# EasyEDA Pro project PelletMonV3.eprj

# Schematic Schematic
Create Date: 2023-02-23; Page Name: P1; Project Name: PelletMonV3; Schematic Name: Schematic; Update Date: 2023-03-02; Company: cziter15/czarnykon; Drawed: Krzysztof Strehlau; Page Size: A4; Part Number: pcbv3; Reviewed: Krzysztof Strehlau; Version: 3
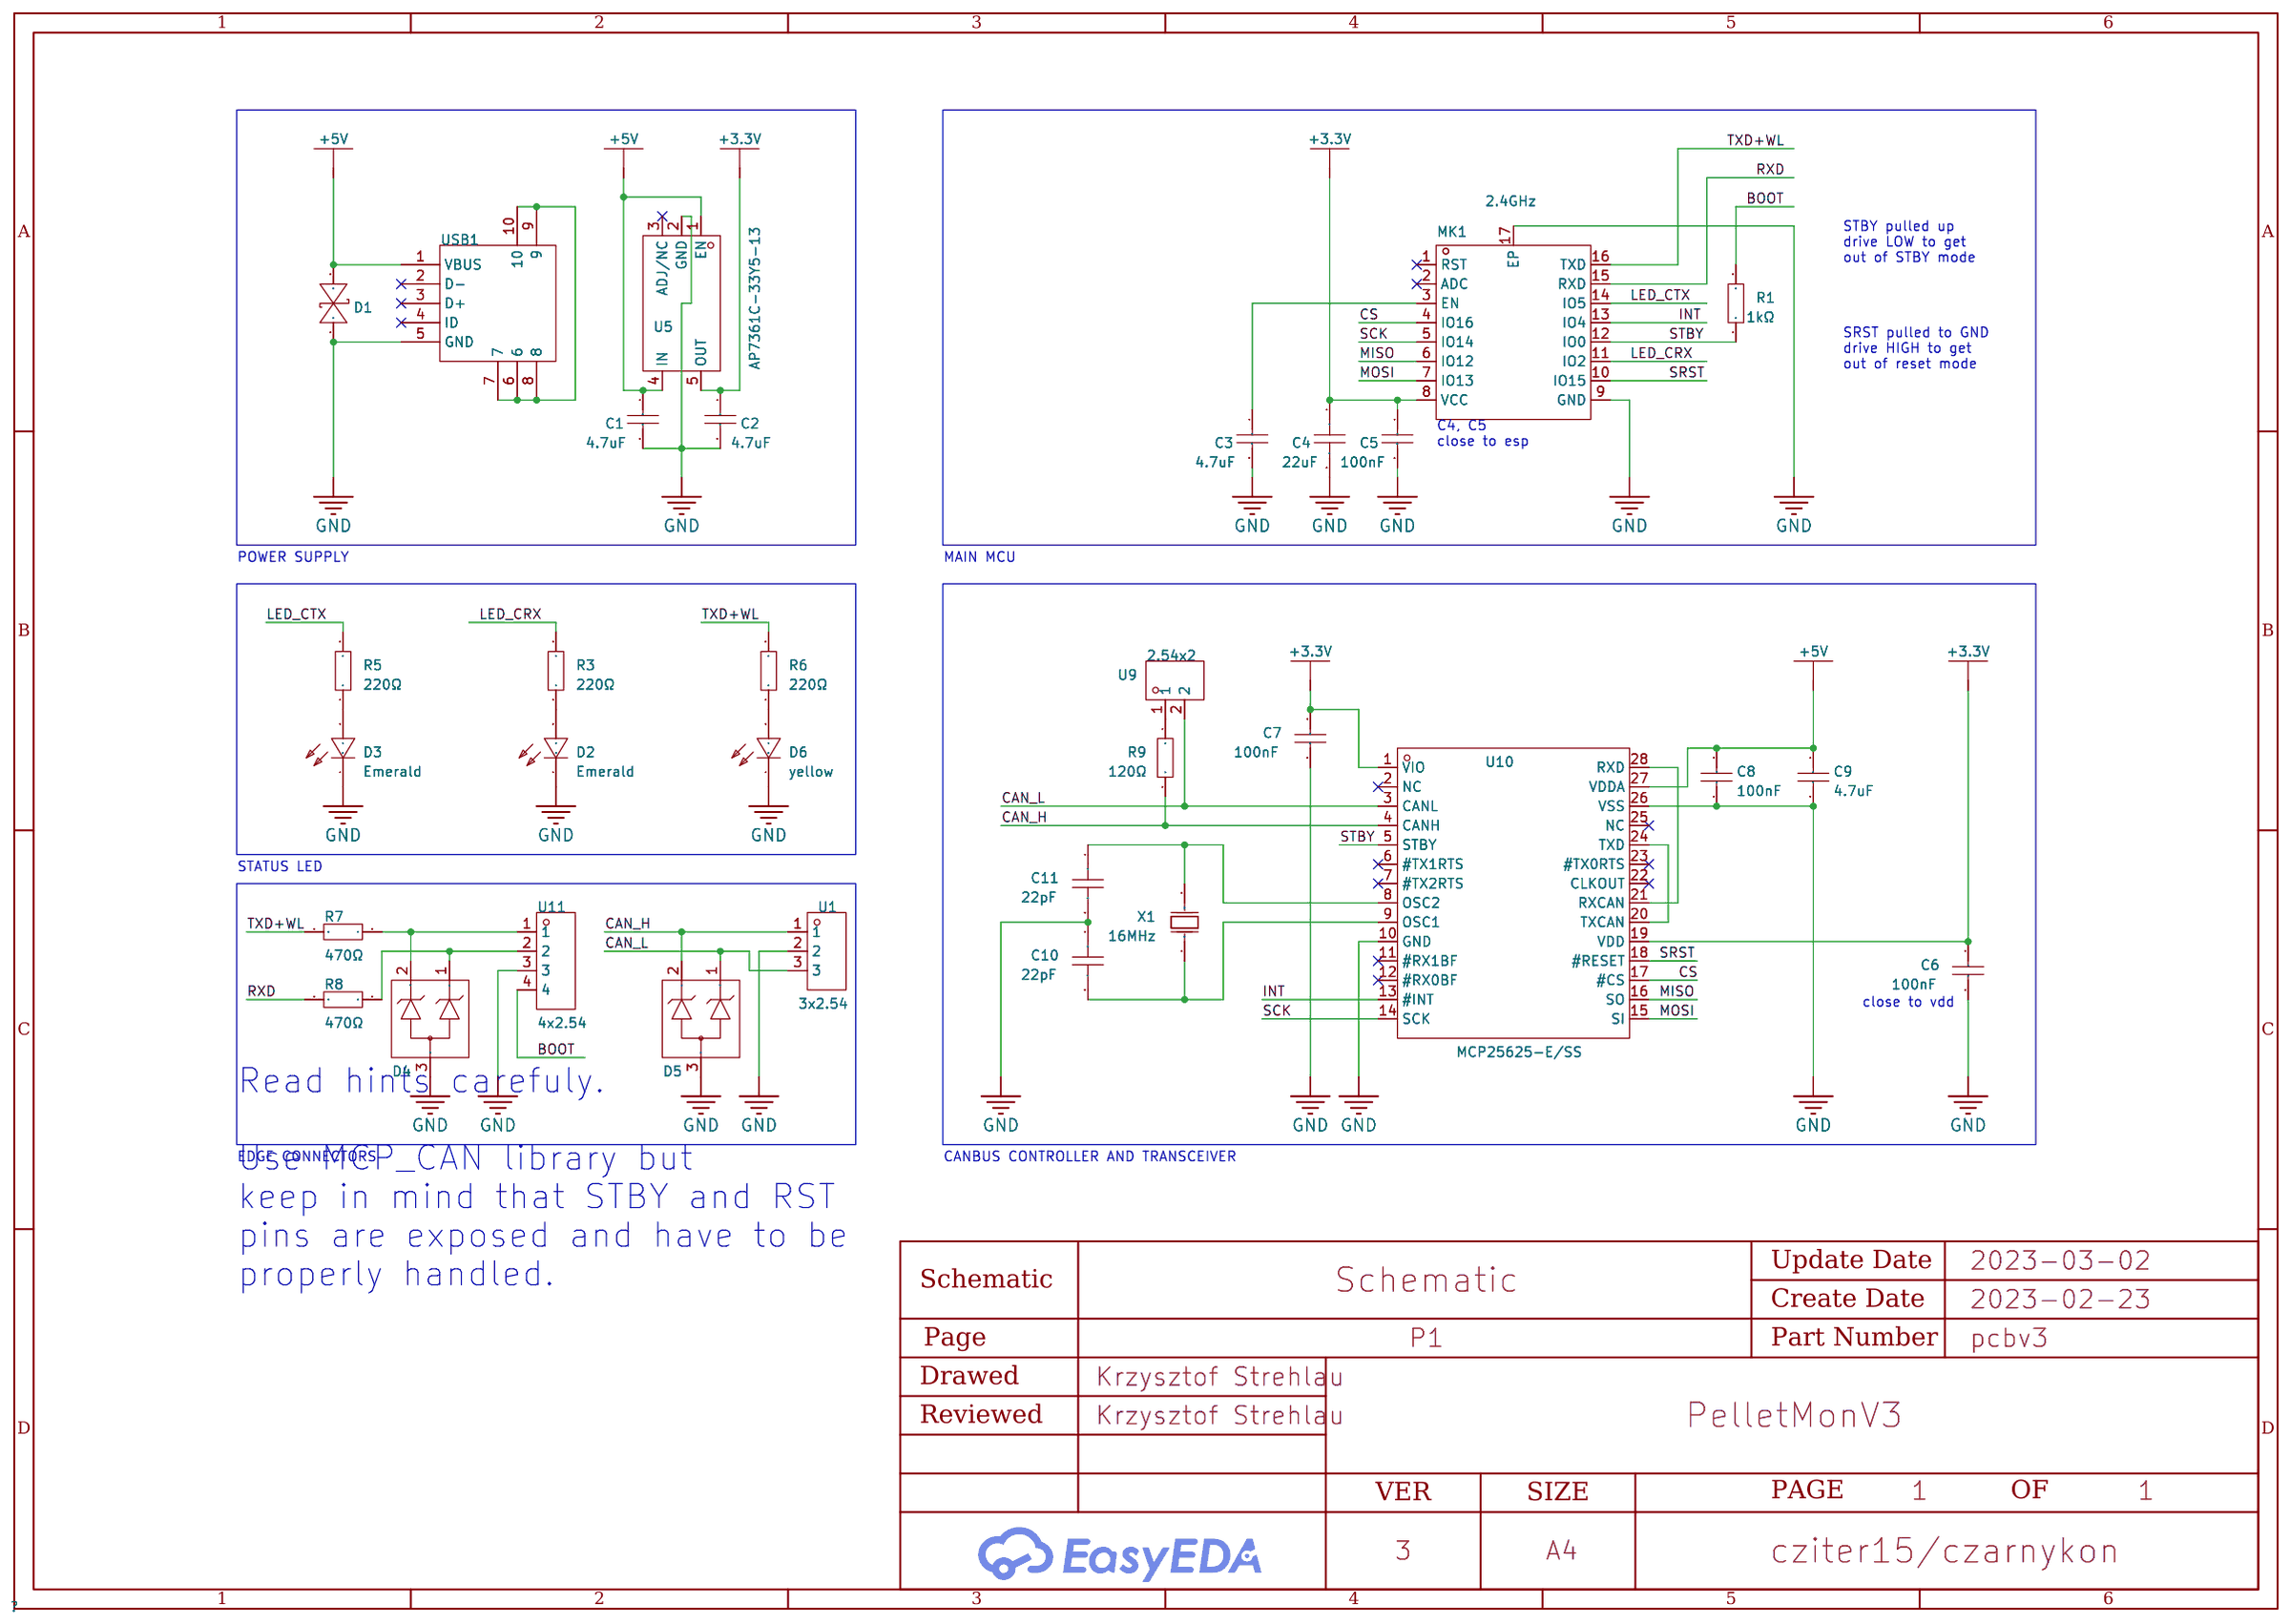
[diagram p0: schematic sheet]

## Parts
C1  4.7uF  [C0805]
C2  4.7uF  [C0805]
C3  4.7uF  [C0805]
C4  22uF  [C0805]
C5  100nF  [C0603]
C6  100nF  [C0603]
C7  100nF  [C0603]
C8  100nF  [C0603]
C9  4.7uF  [C0805]
C10  22pF  [C0603]
C11  22pF  [C0603]
D1  PESD0603-240  [D0603-BI]
D2  Emerald  [LED0603-RD]
D3  Emerald  [LED0603-RD]
D4  PESD3V3S2UT  [SOT-23-3_L3.0-W1.7-P0.95-LS2.9-BR]
D5  PESD2CAN  [SOT-23-3_L2.9-W1.3-P1.90-LS2.4-BR]
D6  yellow  [LED0603-RD]
MK1  2.4GHz  [WIRELM-SMD_ESP-07S]
R1  1kΩ  [R0603]
R3  220Ω  [R0603]
R5  220Ω  [R0603]
R6  220Ω  [R0603]
R7  470Ω  [R0603]
R8  470Ω  [R0603]
R9  120Ω  [R0603]
U1  3x2.54  [CONN-TH_DB125-2.54-3P-GN]
U5  AP7361C-33Y5-13  [SOT-89-5_L4.5-W2.5-P1.50-LS4.5-BR]
U9  2.54x2  [CONN-TH_DB125-2.54-2P-GN]
U10  MCP25625-E/SS  [SSOP-28_L10.2-W5.3-P0.65-LS7.8-BL]
U11  4x2.54  [CONN-TH_DB125-2.54-4P-GN]
USB1  475900001  [MICRO-USB-SMD_47590-0001]
X1  16MHz  [OSC-SMD_L5.0-W3.2]

## Library data of the parts
C1-C3 C9 = CL21A475KAQNNNE: Capacitance: Tolerance:±10% Tolerance:±10% Voltage Rated: Temperature Coefficient:; LCSC Part Name: 4.7uF ±10% 25V; Supplier Part: C1779; Manufacturer: SAMSUNG(三星); Supplier Footprint: 0805; JLCPCB Part Class: Basic Part; Datasheet: https://atta.szlcsc.com/upload/public/pdf/source/20160103/1457707696447.pdf; Supplier: LCSC; Tolerance: ±10%; Check: true
C4 = CL21A226MAQNNNE_C45783: Capacitance: Tolerance:±20% Tolerance:±20% Voltage Rated: Temperature Coefficient:; LCSC Part Name: 22uF ±20% 25V; Supplier Part: C45783; Manufacturer: SAMSUNG(三星); Manufacturer Part: CL21A226MAQNNNE; Supplier Footprint: 0805; JLCPCB Part Class: Basic Part; Datasheet: https://atta.szlcsc.com/upload/public/pdf/source/20160103/1457707727161.pdf; Supplier: LCSC; Tolerance: ±20%; Check: true
C5-C8 = CC0603KRX7R9BB104: Capacitance: Tolerance:±10% Tolerance:±10% Voltage Rated: Temperature Coefficient:; LCSC Part Name: 100nF ±10% 50V; Supplier Part: C14663; Manufacturer: YAGEO(国巨); Supplier Footprint: 0603; JLCPCB Part Class: Basic Part; Datasheet: https://atta.szlcsc.com/upload/public/pdf/source/20170116/1484561234239.pdf; Supplier: LCSC; Tolerance: ±10%; Check: true
C10 C11 = CC0603FRNPO9BN220: Capacitance: Tolerance:±1% Tolerance:±1% Voltage Rated: Temperature Coefficient:; LCSC Part Name: 22pF ±1% 50V; Supplier Part: C326840; Manufacturer: YAGEO(国巨); Supplier Footprint: 0603; JLCPCB Part Class: Extended Part; Datasheet: https://atta.szlcsc.com/upload/public/pdf/source/20181031/C326840_4CFD83C448EE131B1A0D2E7D8F466B49.pdf; Supplier: LCSC; Tolerance: ±1%
D1 = PESD0603-240: Polarity:Bi-Directional Reverse Stand-Off Voltage (Vrwm):5V Breakdown Voltage (Min):6.4V Breakdown Voltage (Max):7V Reverse Leakage Current (Ir):800uA Peak Pulse Current (Ipp)@10/1000μs:43.5A Maximum Clamping Voltage:9.2V; Supplier Part: C133012; Manufacturer: Brightking(君耀电子); Supplier Footprint: 0603; JLCPCB Part Class: Extended Part; Datasheet: https://atta.szlcsc.com/upload/public/pdf/source/20170930/C133012_1506736373101997361.pdf; Supplier: LCSC; Polarity: Bi-Directional; Reverse Stand-Off Voltage (Vrwm): 5V; Breakdown Voltage (Min): 6.4V; Breakdown Voltage (Max): 7V; Reverse Leakage Current (Ir): 800uA; Peak Pulse Current (Ipp)@10/1000μs: 43.5A; Maximum Clamping Voltage: 9.2V
D2 D3 = 19-217/GHC-YR1S2/3T: Emitted Color:Emerald Diode Configuration:- Lens Color:Colorless transparence Dominant Wavelength:520nm~535nm Dominant Wavelength:520nm~535nm Peak Wavelength:518nm Color Temperature:- Color Temperature:- Forward Current:20mA Power Dissipation:110mW Viewin; LCSC Part Name: 翠绿 520nm~535nm; Supplier Part: C72043; Manufacturer: EVERLIGHT(亿光); Supplier Footprint: 0603; JLCPCB Part Class: Basic Part; Datasheet: https://atta.szlcsc.com/upload/public/pdf/source/20160507/1462613613780.pdf; Supplier: LCSC; Lens Color: Colorless transparence; Dominant Wavelength: 520nm~535nm; Peak Wavelength: 518nm; Forward Current: 20mA; Power Dissipation: 110mW; Viewing Angle: 120°; Operating Temperature: -40℃~+85℃
D4 = PESD3V3S2UT: Supplier Part: C388581; Supplier Footprint: SOT-23; JLCPCB Part Class: Extended Part; Datasheet: https://atta.szlcsc.com/upload/public/pdf/source/20190611/C388581_08CD3BED48EF46BEAD1C9C0FD641C393.pdf; Supplier: LCSC
D5 = PESD2CAN: Polarity:Bi-Directional Reverse Stand-Off Voltage (Vrwm):24V@Max Breakdown Voltage:26.7V Peak Pulse Current (Ipp)@10/1000μs:8A@8/20us Maximum Clamping Voltage:54V; LCSC Part Name: 双向 Vrwm:24V@Max; Supplier Part: C284078; Manufacturer: DOWO(东沃); Supplier Footprint: SOT-23; JLCPCB Part Class: Extended Part; Datasheet: https://atta.szlcsc.com/upload/public/pdf/source/20180918/C284078_DC297CB2BF89271044F07577A109ECB3.pdf; Supplier: LCSC; Polarity: Bi-Directional; Reverse Stand-Off Voltage (Vrwm): 24V@Max; Breakdown Voltage: 26.7V; Peak Pulse Current (Ipp)@10/1000μs: 8A@8/20us; Maximum Clamping Voltage: 54V
D6 = 19-213/Y2C-CQ2R2L/3T(CY): Emitted Color:yellow Diode Configuration:- Lens Color:Colorless transparence Dominant Wavelength:585.5nm~591.5nm Dominant Wavelength:585.5nm~591.5nm Peak Wavelength:591nm Color Temperature:- Color Temperature:- Forward Current:20mA Power Dissipation:60mW; LCSC Part Name: 黄灯 585.5nm~591.5nm; Supplier Part: C72038; Manufacturer: EVERLIGHT(亿光); Supplier Footprint: 0603; JLCPCB Part Class: Basic Part; Datasheet: https://atta.szlcsc.com/upload/public/pdf/source/20160507/1462613613586.pdf; Supplier: LCSC; Lens Color: Colorless transparence; Dominant Wavelength: 585.5nm~591.5nm; Peak Wavelength: 591nm; Forward Current: 20mA; Power Dissipation: 60mW; Viewing Angle: 120°; Operating Temperature: -40℃~+85℃
MK1 = ESP-07S_C82895: Frequency:2.4GHz Output Power:19.5dBm Output Power:19.5dBm Core Processor:ESP8266 Support Interface:I2C；HSPI；UART；I2S Antenna Type:PCB 板载天线 Wireless Standard:802.11b/g/n Operating Voltage:3.3V Operating Voltage:3.3V Receive  Current:- Send  Current:- Sens; LCSC Part Name: ESP-07S; Supplier Part: C82895; Manufacturer: Ai-Thinker(安信可); Manufacturer Part: ESP-07S; Supplier Footprint: WIFI Module; JLCPCB Part Class: Extended Part; Datasheet: https://atta.szlcsc.com/upload/public/pdf/source/20161024/1477288471743.pdf; Supplier: LCSC; Output Power: 19.5dBm; Core Processor: ESP8266; Support Interface: I2C；HSPI；UART；I2S; Antenna Type: PCB 板载天线; Wireless Standard: 802.11b/g/n; Operating Voltage: 3.3V; Sensitivity: -98dBm; Operating Temperature: -40℃~+125℃
R1 = 0603WAF1001T5E: Type:Thick Film Resistors Resistance: Tolerance:±1% Tolerance:±1% Power(Watts): Temperature Coefficient:±100ppm/℃ Temperature Coefficient:±100ppm/℃ Overload Voltage (Max): Operating Temperature Range:-55℃~+155℃ Operating Temperature Range:-55℃~+155℃; LCSC Part Name: 1kΩ ±1% 100mW; Supplier Part: C21190; Manufacturer: UNI-ROYAL(厚声); Supplier Footprint: 0603; JLCPCB Part Class: Basic Part; Datasheet: https://atta.szlcsc.com/upload/public/pdf/source/20200306/C422600_1E6D84923E4A46A82E41ADD87F860B5C.pdf; Supplier: LCSC; Type: Thick Film Resistors; Tolerance: ±1%; Temperature Coefficient: ±100ppm/℃; Operating Temperature Range: -55℃~+155℃
R3 R5 R6 = 0603WAF2200T5E: Type:Thick Film Resistors Resistance: Tolerance:±1% Tolerance:±1% Power(Watts): Temperature Coefficient:±100ppm/℃ Temperature Coefficient:±100ppm/℃ Overload Voltage (Max): Operating Temperature Range:-55℃~+155℃ Operating Temperature Range:-55℃~+155℃; LCSC Part Name: 220Ω ±1% 100mW; Supplier Part: C22962; Manufacturer: UNI-ROYAL(厚声); Supplier Footprint: 0603; JLCPCB Part Class: Basic Part; Datasheet: https://atta.szlcsc.com/upload/public/pdf/source/20200306/C422600_1E6D84923E4A46A82E41ADD87F860B5C.pdf; Supplier: LCSC; Type: Thick Film Resistors; Tolerance: ±1%; Temperature Coefficient: ±100ppm/℃; Operating Temperature Range: -55℃~+155℃; Check: true
R7 R8 = 0603WAF4700T5E: Type:Thick Film Resistors Resistance: Tolerance:±1% Tolerance:±1% Power(Watts): Temperature Coefficient:±100ppm/℃ Temperature Coefficient:±100ppm/℃ Overload Voltage (Max): Operating Temperature Range:-55℃~+155℃ Operating Temperature Range:-55℃~+155℃; LCSC Part Name: 470Ω(4700) ±1% 编带; Supplier Part: C23179; Manufacturer: UNI-ROYAL(厚声); Supplier Footprint: 0603; JLCPCB Part Class: Basic Part; Datasheet: https://atta.szlcsc.com/upload/public/pdf/source/20170920/C23179_1505901118208982562.pdf; Supplier: LCSC; Tolerance: ±1%; Temperature Coefficient: ±100ppm/℃; Operating Temperature Range: -55℃~+155℃; Type: Thick Film Resistors; Check: true
R9 = 0603WAF1200T5E: Type:Thick Film Resistors Resistance: Tolerance:±1% Tolerance:±1% Power(Watts): Temperature Coefficient:±100ppm/℃ Temperature Coefficient:±100ppm/℃ Overload Voltage (Max): Operating Temperature Range:-55℃~+155℃ Operating Temperature Range:-55℃~+155℃; LCSC Part Name: 120Ω ±1% 100mW; Supplier Part: C22787; Manufacturer: UNI-ROYAL(厚声); Supplier Footprint: 0603; JLCPCB Part Class: Basic Part; Datasheet: https://atta.szlcsc.com/upload/public/pdf/source/20200306/C422600_1E6D84923E4A46A82E41ADD87F860B5C.pdf; Supplier: LCSC; Type: Thick Film Resistors; Tolerance: ±1%; Temperature Coefficient: ±100ppm/℃; Operating Temperature Range: -55℃~+155℃
U1 = DB125-2.54-3P-GN-S: Pitch:2.54mm Number of Rows:1 Number of PINs Per Row:3 Mounting Style:直针 Current Rating (Max):8A Voltage Rating (Max):130V Wire Gauge - AWG:18~26 Wire Gauge - AWG:18~26 Wire Gauge - mm2:0.5~1 Wire Gauge - mm2:0.5~1 Operating Temperature Range:-40℃~+105℃ O; LCSC Part Name: 2.54mm 排数:1 每排P数:3 直针; Supplier Part: C918121; Manufacturer: DIBO(地博电气); Supplier Footprint: 插件,P=2.54mm; JLCPCB Part Class: Extended Part; Datasheet: https://atta.szlcsc.com/upload/public/pdf/source/20201111/C918120_C9DB7F6F3DB366529A80D61CABEEDAE6.pdf; Supplier: LCSC; Pitch: 2.54mm; Number of Rows: 1; Number of PINs Per Row: 3; Mounting Style: 直针; Current Rating (Max): 8A; Voltage Rating (Max): 130V; Wire Gauge - AWG: 18~26; Wire Gauge - mm2: 0.5~1; Operating Temperature Range: -40℃~+105℃; Check: true
U5 = AP7361C-33Y5-13: Output Type: Output Polarity:Positive Number of Outputs:1 Maximum Input Voltage:6V Output Voltage:3.3V~3.3V Output Voltage:3.3V~3.3V Dropout Voltage:360mV@(1A) Output Current:1A Power Supply Rejection Ratio (PSRR):75dB@(1kHz),55dB@(10kHz); LCSC Part Name: 正 Vin=6V Vout=3.3V 1A 75dB; Supplier Part: C460397; Manufacturer: DIODES(美台); Supplier Footprint: SOT-89-5; JLCPCB Part Class: Extended Part; Datasheet: https://atta.szlcsc.com/upload/public/pdf/source/20191127/C460397_F4F6F327541BE4867462406DC5457012.pdf; Supplier: LCSC; Output Polarity: Positive; Number of Outputs: 1; Maximum Input Voltage: 6V; Output Voltage: 3.3V~3.3V; Dropout Voltage: 360mV@(1A); Output Current: 1A; Power Supply Rejection Ratio (PSRR): 75dB@(1kHz),55dB@(10kHz); Check: true
U9 = DB125-2.54-2P-GN-S: Pitch:2.54mm Number of Rows:1 Number of PINs Per Row:2 Mounting Style:直针 Current Rating (Max):8A Voltage Rating (Max):130V Wire Gauge - AWG:18~26 Wire Gauge - mm?:0.5~1 Operating Temperature Range:-40℃~+105℃ Operating Temperature Range:-40℃~+105℃ Color:Gr; LCSC Part Name: 2.54mm 排数:1 每排P数:2 直针; Supplier Part: C918120; Manufacturer: DIBO(地博电气); Supplier Footprint: 直插,P=2.54mm; JLCPCB Part Class: Extended Part; Datasheet: https://atta.szlcsc.com/upload/public/pdf/source/20201111/C918120_C9DB7F6F3DB366529A80D61CABEEDAE6.pdf; Supplier: LCSC; Pitch: 2.54mm; Number of Rows: 1; Number of PINs Per Row: 2; Mounting Style: 直针; Current Rating (Max): 8A; Voltage Rating (Max): 130V; Wire Gauge - AWG: 18~26; Wire Gauge - mm?: 0.5~1; Operating Temperature Range: -40℃~+105℃; Color: Green
U10 = MCP25625-E/SS: Type:Transceiver Supply Voltage:2.7V~5.5V Supply Voltage:2.7V~5.5V; Supplier Part: C184944; Manufacturer: MICROCHIP(美国微芯); Supplier Footprint: SSOP-28-208mil; JLCPCB Part Class: Extended Part; Datasheet: https://atta.szlcsc.com/upload/public/pdf/source/20180423/C184944_80753FA2C0E1141C9DB231D3403DA011.pdf; Supplier: LCSC; Type: Transceiver; Supply Voltage: 2.7V~5.5V
U11 = DB125-2.54-4P-GN-S: Pitch:2.54mm Number of Rows:1 Number of PINs Per Row:4 Mounting Style:直针 Current Rating (Max):8A Voltage Rating (Max):130V Wire Gauge - AWG:18~26 Wire Gauge - AWG:18~26 Wire Gauge - mm2:0.5~1 Wire Gauge - mm2:0.5~1 Operating Temperature Range:-40℃~+105℃ O; LCSC Part Name: 2.54mm 排数:1 每排P数:4 直针; Supplier Part: C918122; Manufacturer: DIBO(地博电气); Supplier Footprint: 插件,P=2.54mm; JLCPCB Part Class: Extended Part; Datasheet: https://atta.szlcsc.com/upload/public/pdf/source/20230106/BCD3A0BE1EB95DC3E813F1745F022035.pdf; Supplier: LCSC; Pitch: 2.54mm; Number of Rows: 1; Number of PINs Per Row: 4; Mounting Style: 直针; Current Rating (Max): 8A; Voltage Rating (Max): 130V; Wire Gauge - AWG: 18~26; Wire Gauge - mm2: 0.5~1; Operating Temperature Range: -40℃~+105℃; Color: Green
USB1 = 475900001: Connector Type:Micro-AB Standard:- Gender:Female Number of Contacts:5 Number of Ports:1; LCSC Part Name: Micro-AB 母座; Supplier Part: C136001; Manufacturer: MOLEX; Supplier Footprint: SMD; JLCPCB Part Class: Extended Part; Datasheet: https://atta.szlcsc.com/upload/public/pdf/source/20171113/C136001_15105610887281115466.pdf; Supplier: LCSC; Connector Type: Micro-AB; Gender: Female; Number of Contacts: 5; Number of Ports: 1; Check: true
X1 = X503216MSB2GI: Crystal Type:SMD Crystal Resonator Frequency: Frequency Tolerance:±10ppm Frequency Tolerance:±10ppm Frequency Stability:±50ppm Frequency Stability:±50ppm Load Capacitance: Operating Temperature: Operating Temperature:; LCSC Part Name: YSX530GA 16MHz ±10ppm 20pF; Supplier Part: C112572; Manufacturer: YXC(扬兴晶振); Supplier Footprint: SMD5032-2P; JLCPCB Part Class: Extended Part; Datasheet: https://atta.szlcsc.com/upload/public/pdf/source/20210329/C112559_847D3CACBA33ACCEB57DEA3AEBB187A1.pdf; Supplier: LCSC; Crystal Type: SMD Crystal Resonator; Frequency Tolerance: ±10ppm; Frequency Stability: ±50ppm

## Nets
+3.3V: C2.1 C4.1 C5.1 C6.2 C7.2 MK1.8(VCC) U5.5(OUT) U10.1(VIO) U10.19(VDD)
+5V: C1.1 C8.2 C9.1 D1.2 U5.1(EN) U5.4(IN) U10.27(VDDA) USB1.1(VBUS)
GND: C1.2 C2.2 C3.2 C4.2 C5.2 C6.1 C7.1 C8.1 C9.2 C10.1 C11.2 D1.1 D2.1(C) D3.1(C) D4.3(CA) D5.3(CA) D6.1(C) MK1.9(GND) MK1.17(EP) U1.2 U5.2(GND) U10.10(GND) U10.26(VSS) U11.3 USB1.5(GND)
BOOT: R1.2 U11.4
CAN_H: D5.2(K2) R9.2 U1.1 U10.4(CANH)
CAN_L: D5.1(K1) U1.3 U9.2 U10.3(CANL)
CS: MK1.4(IO16) U10.17(#CS)
INT: MK1.13(IO4) U10.13(#INT)
LED_CRX: MK1.11(IO2) R3.2
LED_CTX: MK1.14(IO5) R5.2
MISO: MK1.6(IO12) U10.16(SO)
MOSI: MK1.7(IO13) U10.15(SI)
RXD: MK1.15(RXD) R8.2
SCK: MK1.5(IO14) U10.14(SCK)
SRST: MK1.10(IO15) U10.18(#RESET)
STBY: MK1.12(IO0) R1.1 U10.5(STBY)
TXD+WL: MK1.16(TXD) R6.2 R7.2
$1N400: USB1.6 USB1.7 USB1.8 USB1.9 USB1.10
$1N1043: C3.1 MK1.3(EN)
$1N1283: D4.2(K2) R7.1 U11.1
$1N1284: D4.1(K1) R8.1 U11.2
$1N21584: U10.21(RXCAN) U10.28(RXD)
$1N23723: C11.1 U10.8(OSC2) X1.2(OSC2)
$1N23749: C10.2 U10.9(OSC1) X1.1(OSC1)
$1N23915: U10.20(TXCAN) U10.24(TXD)
$1N27585: D3.2(A) R5.1
$1N37407: R9.1 U9.1
$1N51662: D2.2(A) R3.1
$1N51925: D6.2(A) R6.1

Not connected (* = marked no-connect by the designer): MK1 1(RST)* 2(ADC)*; U5 3(ADJ/NC)*; U10 2(NC)* 6(#TX1RTS)* 7(#TX2RTS)* 11(#RX1BF)* 12(#RX0BF)* 22(CLKOUT)* 23(#TX0RTS)* 25(NC)*; USB1 2(D-)* 3(D+)* 4(ID)*

## Notes on the sheet
- STBY pulled up
  drive LOW to get
  out of STBY mode
- SRST pulled to GND
  drive HIGH to get
  out of reset mode
- C4, C5
  close to esp
- POWER SUPPLY
- MAIN MCU
- STATUS LED
- close to vdd
- EDGE CONNECTORS
- CANBUS CONTROLLER AND TRANSCEIVER
- Read hints carefuly.
  Use MCP_CAN library but
  keep in mind that STBY and RST
  pins are exposed and have to be
  properly handled.

# Board PCB
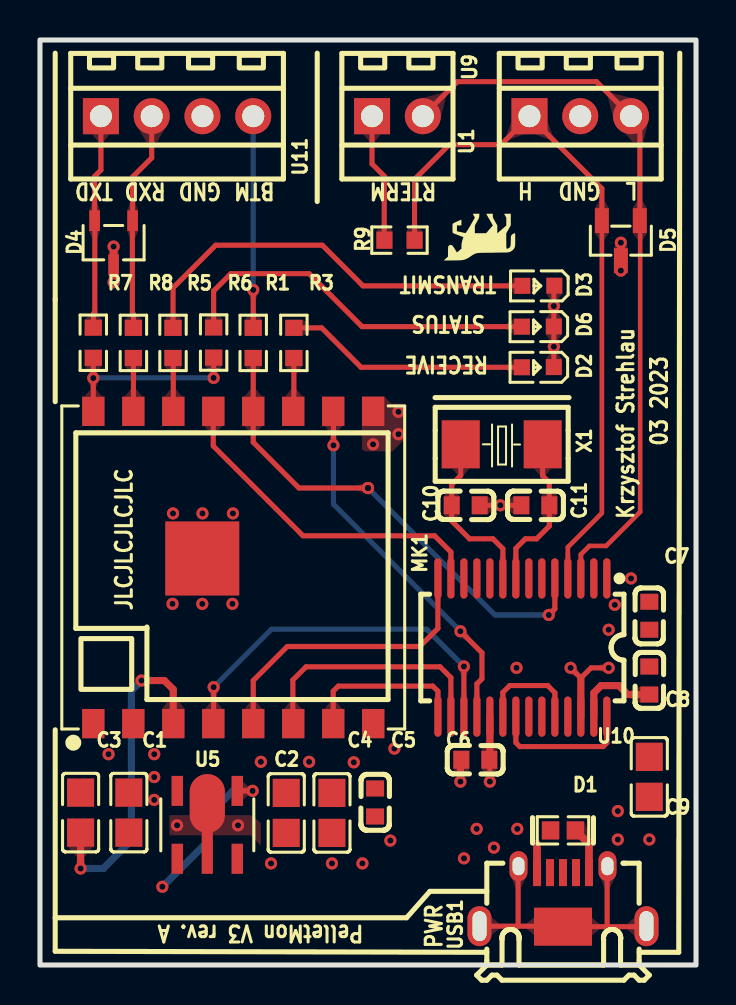
[diagram p1: board, top side]
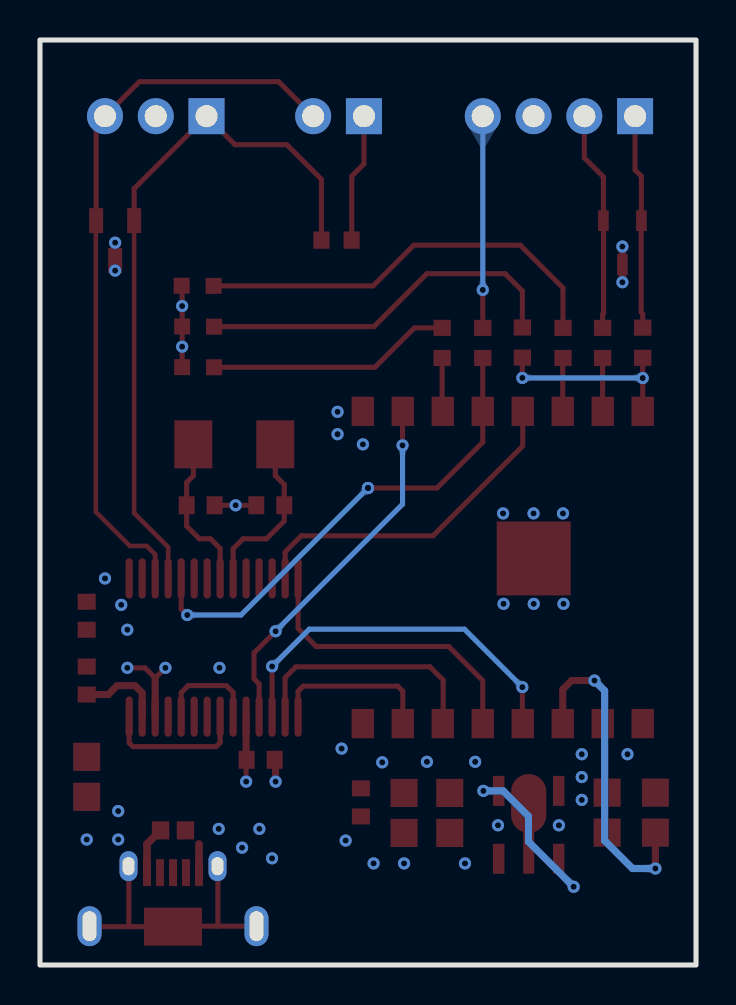
[diagram p2: board, bottom side, seen from below]

Outline 32.82 x 46.25 mm; copper layers: Top Layer, Inner1, Inner2, Bottom Layer. Coordinates in mm from the lower left corner of the outline.
Outline path: rectangle 0,46.25 32.82,0
Stack: Top Layer 0.035mm / Dielectric1 0.48mm PP er 4.5 / Inner1 0.035mm / Dielectric2 0.48mm FR4 er 4.5 / Inner2 0.035mm / Dielectric3 0.48mm PP er 4.5 / Bottom Layer 0.035mm

## Design rules (mm)
spacing safeClearance (default): track to track 0.152, other pairs 0.152 to 0.3
track width trackWidth (default): min 0.127, default 0.254, max 2.54
differential pair differentialPair (default): width min 0.127, default 0.254, max 2.54; gap min 0.152, default 0.152
via viaSize (default): diameter min 0.5, default 0.61, max 10; hole min 0.3, default 0.305, max 6

## Placement (name value [footprint] x y rotation side)
C1  4.7uF  [C0805]  4.44 7.62 90 top
C2  4.7uF  [C0805]  12.32 7.6 270 top
C3  4.7uF  [C0805]  2.03 7.62 90 top
C4  22uF  [C0805]  14.6 7.6 270 top
C5  100nF  [C0603]  16.76 8.13 270 top
C6  100nF  [C0603]  21.78 10.26 0 top
C7  100nF  [C0603]  30.48 17.46 90 top
C8  100nF  [C0603]  30.48 14.22 270 top
C9  4.7uF  [C0805]  30.48 9.41 270 top
C10  22pF  [C0603]  21.3 22.99 180 top
C11  22pF  [C0603]  24.78 22.99 180 top
D1  PESD0603-240  [D0603-BI]  26.16 6.73 0 top
D2  Emerald  [LED0603-RD]  24.91 29.89 180 top
D3  Emerald  [LED0603-RD]  24.93 33.96 180 top
D4  PESD3V3S2UT  [SOT-23-3_L3.0-W1.7-P0.95-LS2.9-BR]  3.68 36.12 90 top
D5  PESD2CAN  [SOT-23-3_L2.9-W1.3-P1.90-LS2.4-BR]  29.06 36.22 90 top
D6  yellow  [LED0603-RD]  24.91 31.92 180 top
MK1  2.4GHz  [WIRELM-SMD_ESP-07S]  9.67 19.88 0 top
R1  1kΩ  [R0603]  10.67 31.11 90 top
R3  220Ω  [R0603]  12.7 31.11 270 top
R5  220Ω  [R0603]  6.66 31.11 270 top
R6  220Ω  [R0603]  8.69 31.12 270 top
R7  470Ω  [R0603]  2.67 31.11 270 top
R8  470Ω  [R0603]  4.67 31.11 270 top
R9  120Ω  [R0603]  17.98 36.25 0 top
U1  3x2.54  [CONN-TH_DB125-2.54-3P-GN]  27.03 42.44 0 top
U5  AP7361C-33Y5-13  [SOT-89-5_L4.5-W2.5-P1.50-LS4.5-BR]  8.37 7.01 270 top
U9  2.54x2  [CONN-TH_DB125-2.54-2P-GN]  17.88 42.44 0 top
U10  MCP25625-E/SS  [SSOP-28_L10.2-W5.3-P0.65-LS7.8-BL]  24.13 15.87 180 top
U11  4x2.54  [CONN-TH_DB125-2.54-4P-GN]  6.86 42.44 0 top
USB1  475900001  [MICRO-USB-SMD_47590-0001]  26.16 3.43 0 top
X1  16MHz  [OSC-SMD_L5.0-W3.2]  23.1 26.03 0 top

## Footprints (pads in the part's own frame, mm; a bottom-side part is the same pattern mirrored in y, then rotated)
C0603
  rect 0.8x0.9 smd: 1(-0.7,0) 2(0.7,0)
C0805
  rect 1.41x1.35 smd: 1(-1,0) 2(1,0)
CONN-TH_DB125-2.54-2P-GN
  rect 1.8x1.8 hole 1.1: 1(-1.27,0)
  round 1.8 hole 1.1: 2(1.27,0)
CONN-TH_DB125-2.54-3P-GN
  rect 1.8x1.8 hole 1.1: 1(-2.54,0)
  round 1.8 hole 1.1: 2(0,0) 3(2.54,0)
CONN-TH_DB125-2.54-4P-GN
  rect 1.8x1.8 hole 1.1: 1(-3.81,0)
  round 1.8 hole 1.1: 2(-1.27,0) 3(1.27,0) 4(3.81,0)
D0603-BI
  rect 0.873x0.907 smd: 1(-0.622,0) 2(0.622,0)
LED0603-RD
  rect 0.8x0.8 smd: 1(-0.799,-0.004) 2(0.799,0.004)
MICRO-USB-SMD_47590-0001
  rect 0.4x1.35 smd: 1(1.3,1.192) 2(0.65,1.192) 3(0,1.192) 4(-0.65,1.192) 5(-1.299,1.192)
  oval 0.9x1.5 hole 0.6x0.9: 6(-2.225,1.512) 7(2.225,1.512)
  oval 1.2x2 hole 0.7x1.5: 8(4.175,-1.488) 9(-4.175,-1.488)
  rect 2.9x1.9 smd: 10(0,-1.512)
OSC-SMD_L5.0-W3.2
  rect 1.9x2.4 smd: 1(-2.05,0) 2(2.05,0)
R0603
  rect 0.806x0.864 smd: 1(-0.753,0) 2(0.753,0)
SOT-23-3_L2.9-W1.3-P1.90-LS2.4-BR
  rect 1.25x0.7 smd: 1(1,-0.95) 2(1,0.95) 3(-1,0)
SOT-23-3_L3.0-W1.7-P0.95-LS2.9-BR
  rect 1.038x0.532 smd: 1(1.101,-0.95) 2(1.101,0.95) 3(-1.101,0)
SOT-89-5_L4.5-W2.5-P1.50-LS4.5-BR
  rect 1.5x0.574 smd: 1(1.698,-1.5) 3(1.698,1.5) 4(-1.698,1.5) 5(-1.698,-1.5)
  oval 2.94x1.76 smd: 2(-1.067,0)
  rect 2.209x0.552 smd: 2(1.343,0)
SSOP-28_L10.2-W5.3-P0.65-LS7.8-BL
  oval 0.364x2.015 smd: 1(-4.225,-3.455) 2(-3.575,-3.455) 3(-2.925,-3.455) 4(-2.275,-3.455) 5(-1.625,-3.455) 6(-0.975,-3.455) 7(-0.325,-3.455) 8(0.325,-3.455) 9(0.975,-3.455) 10(1.625,-3.455) 11(2.275,-3.455) 12(2.925,-3.455) 13(3.575,-3.455) 14(4.225,-3.455) 15(4.225,3.455) 16(3.575,3.455) 17(2.925,3.455) 18(2.275,3.455) 19(1.625,3.455) 20(0.975,3.455) 21(0.325,3.455) 22(-0.325,3.455) 23(-0.975,3.455) 24(-1.625,3.455) 25(-2.275,3.455) 26(-2.925,3.455) 27(-3.575,3.455) 28(-4.225,3.455)
WIRELM-SMD_ESP-07S
  rect 1.12x1.465 smd: 1(-7,-7.808) 2(-5,-7.808) 3(-3,-7.808) 4(-1,-7.808) 5(1,-7.808) 6(3,-7.808) 7(5,-7.808) 8(7,-7.808) 9(7,7.808) 10(5,7.808) 11(3,7.808) 12(1,7.808) 13(-1,7.808) 14(-3,7.808) 15(-5,7.808) 16(-7,7.808)
  rect 3.7x3.7 smd: 17(-1.55,0.45)

## Nets
As in the schematic.

Pads without a net: MK1 1 2; U5 3; U10 2 6 7 11 12 22 23 25; USB1 2 3 4

## Via types
v1: diameter 0.61, hole 0.305, Top Layer to Bottom Layer, 59 vias

## Routing (per net, layer and track width the routed paths; a pad name or vN(x,y) marks a point on that pad's centre or on a via; arc(x,y) is an arc through that point)
+3.3V: length 3.3
  Top Layer w0.254: C6.2 22.5,10.24 v1(22.5,9.17)
  Top Layer w0.355: U10.19 22.5,10.29 C6.2
  vias: v1(11.05,10.16) v1(13.46,10.16) v1(15.7,10.13) v1(17.73,10.82) v1(28.75,18.01) v1(29.57,19.33)
+5V: length 14.7
  Top Layer w0.254: v1(10.64,8.71) U5.4
  Top Layer w0.355: U10.27 27.7,13.61 28.07,13.97 28.96,13.97 29.4,13.52 C8.2
  Top Layer w0.381: D1.2 27.46,6.05 USB1.1
  Bottom Layer w0.355: v1(6.12,3.91) 8.38,6.17 8.38,7.44 9.65,8.71 v1(10.64,8.71)
GND: length 16.1
  Top Layer w0.254: v1(28.45,14.86) 27.57,14.86 27.05,14.35 v1(26.54,14.86) ; C10.1 v1(23.03,22.99) 24.08,22.99 ; D2.1 v1(25.7,30.92) D6.1 v1(25.7,32.95) 25.7,33.94 D3.1
  Top Layer w0.355: v1(21.03,9.17) 21.03,10.21 21.08,10.26 ; 27.05,12.42 27.05,14.35
  Top Layer w0.381: v1(29.06,34.72) D5.3 v1(29.06,36.12) ; v1(3.68,34.14) D4.3 v1(3.68,35.92) ; USB1.5 24.86,6.05
  vias: v1(3.43,10.54) v1(5.72,10.54) v1(5.72,9.4) v1(5.72,8.25) v1(6.63,18.06) v1(6.66,22.58) v1(6.86,6.98) v1(8.13,22.58) v1(8.12,18.06) v1(9.63,18.06) v1(9.65,22.58) v1(9.91,6.98) v1(11.56,5.08) v1(14.6,5.08) v1(16.13,5.08) v1(16.66,26.03) v1(17.53,6.22) v1(17.93,27.66) v1(17.93,26.54) v1(21.21,5.33) v1(21.84,6.81) v1(22.71,5.87) v1(23.84,14.86) v1(23.88,6.81) v1(28.45,16.76) v1(28.91,7.7) v1(28.91,6.27) v1(30.48,6.27)
BOOT: length 10.6
  Top Layer w0.254: 10.67,31.86 v1(10.67,33.76)
  Bottom Layer w0.254: U11.4 v1(10.67,33.76)
CAN_H: length 35.4
  Top Layer w0.229: D5.2 28.11,22.6 26.41,20.89 U10.4
  Top Layer w0.254: R9.2 18.74,39.28 20.47,41.02 23.06,41.02 U1.1 28.11,38.82 D5.2
CAN_L: length 36.9
  Top Layer w0.229: D5.1 30.02,37.2 30.02,22.66 28.32,20.95 27.48,20.95 27.05,20.53 27.05,19.33
  Top Layer w0.254: U9.2 20.88,44.17 27.84,44.17 U1.3 30.01,42 D5.1
CS: length 18.8
  Top Layer w0.254: v1(21.2,14.93) U10.17 ; v1(8.69,13.89) 8.69,12.09 MK1.4
  Bottom Layer w0.254: v1(21.2,14.93) 19.35,16.79 11.58,16.79 v1(8.69,13.89)
INT: length 17.1
  Top Layer w0.254: 20.55,19.33 20.55,20.65 19.74,21.46 13.16,21.46 8.67,25.95 MK1.13
LED_CRX: length 2.7
  Top Layer w0.254: MK1.11 12.7,27.72 R3.2
LED_CTX: length 2.7
  Top Layer w0.254: MK1.14 6.67,30.34 R5.2
MISO: length 12.5
  Top Layer w0.254: MK1.6 12.65,12.09 12.65,14.25 13.31,14.91 20.01,14.91 20.55,14.37 20.55,12.42
MOSI: length 8.3
  Top Layer w0.254: MK1.7 14.67,13.69 14.92,13.94 19.65,13.94 19.91,13.69 U10.15
RXD: length 2.7
  Top Layer w0.254: MK1.15 4.67,27.69 R8.2
SCK: length 15
  Top Layer w0.254: MK1.5 10.67,14.22 12.37,15.93 19,15.93 19.91,16.83 U10.14
SRST: length 18.5
  Top Layer w0.254: MK1.10 14.68,27.67 v1(14.68,25.98) ; U10.18 21.85,14.06 22.11,14.31 22.11,15.61 v1(21.03,16.69)
  Bottom Layer w0.254: v1(21.03,16.69) 14.68,23.04 v1(14.68,25.98)
STBY: length 24.5
  Top Layer w0.254: U10.5 25.75,17.8 v1(25.45,17.5) ; v1(16.41,23.85) 12.95,23.85 10.67,26.14 MK1.12 R1.1
  Bottom Layer w0.254: v1(16.41,23.85) 22.76,17.5 v1(25.45,17.5)
TXD+WL: length 9.7
  Top Layer w0.254: R7.2 v1(2.67,29.35) 2.67,27.69 ; v1(8.69,29.36) 8.69,30.37
  Bottom Layer w0.254: v1(8.69,29.36) 2.67,29.36 v1(2.67,29.35)
$1N400: length 14.4
  Top Layer w0.254: USB1.7 28.37,4.92 28.37,1.92 ; 28.37,1.92 30.31,1.92 USB1.8 ; 28.37,1.92 USB1.10 26.14,1.94 23.92,1.94 ; 23.92,1.94 USB1.9 ; 23.92,1.94 23.92,4.92 USB1.6
$1N1043: length 16.6
  Top Layer w0.355: v1(5.08,14.22) 6.22,14.22 6.67,13.78 MK1.3 ; C3.1 v1(2.03,4.83)
  Bottom Layer w0.355: v1(2.03,4.83) 3.17,4.83 4.57,6.22 4.57,13.72 v1(5.08,14.22)
$1N1283: length 10.8
  Top Layer w0.254: 2.73,37.26 D4.2 ; 2.73,37.26 2.73,39.44 3.05,39.75 U11.1 ; 2.73,37.26 2.74,37.25 2.74,32.64 2.67,32.56 R7.1
$1N1284: length 11
  Top Layer w0.254: 4.63,37.26 4.63,39.41 5.59,40.36 U11.2 ; 4.63,37.26 D4.1 ; 4.63,37.26 4.62,37.25 4.62,32.59 4.67,32.54 4.67,31.86
$1N21584: length 7.3
  Top Layer w0.254: U10.28 28.35,11.11 28.17,10.92 24,10.92 23.8,11.12 U10.21
$1N23723: length 7.9
  Top Layer w0.254: X1.2 25.15,24.46 25.48,24.13 C11.1 25.48,21.95 24.84,21.31 24.28,21.31 23.8,20.83 U10.8
$1N23749: length 8.6
  Top Layer w0.254: X1.1 21.05,24.47 20.6,24.03 C10.2 20.6,22.2 21.49,21.31 22.66,21.31 23.16,20.81 U10.9
$1N23915: length 5.3
  Top Layer w0.254: U10.24 25.75,13.61 25.4,13.97 23.5,13.97 23.16,13.63 U10.20
$1N27585: length 21.2
  Top Layer w0.254: 24.13,33.96 16.15,33.96 14.12,35.99 8.79,35.99 6.66,33.86 6.66,31.86
$1N37407: length 6.5
  Top Layer w0.254: R9.1 17.22,36.25 17.22,39.45 16.61,40.06 U9.1
$1N51662: length 12.2
  Top Layer w0.254: 12.7,31.86 14.09,31.86 16.06,29.89 D2.2
$1N51925: length 18.7
  Top Layer w0.254: R6.1 8.69,33.71 9.55,34.57 13.46,34.57 16.11,31.92 D6.2

## Copper pours and planes (outline as drawn; the poured copper is in the pictures)
+3.3V on Top Layer: 28.17,17.7 31.39,17.7 31.39,20.24 28.17,20.24
+3.3V on Top Layer: 6.5,7.9 7.21,7.9 7.21,9.63 7.42,9.83 10.23,9.83 11.56,8.97 11.56,7.87 15.51,7.87 16.26,8.38 17.27,8.38 18.29,9.91 18.29,12.95 15.75,12.95 15.75,10.92 6.5,10.9
+3.3V on Inner2: 0.26,46 32.56,46 32.56,0.26 0.26,0.26
+5V on Top Layer: 31.39,9.68 31.39,14.05 29.67,14.05 29.67,11.56 28.09,9.98 25.7,9.98 23.88,8.51 20.12,8.51 18.8,7.11 18.8,5.33 17.27,3.81 7.24,3.81 7.24,6.1 5.33,6.1 5.34,7.36 3.56,7.37 3.56,3.81 4.32,2.79 18.27,2.79 20.19,4.95 20.19,6.35 21.21,7.62 26.03,7.62 26.29,7.37 26.29,5.71 27.63,5.71 27.69,7.75 29.67,9.68
GND on Top Layer: 25.91,16.84 23.88,16.84 22.71,18.01 22.71,20.14 22.3,20.14 22.3,16.59 23.32,15.57 23.32,14.71 23.47,14.5 31.39,14.5 31.39,17.25 26.31,17.25
GND on Top Layer: 18.03,7.11 17.27,7.87 16.26,7.87 15.49,7.11 10.92,7.11 10.92,4.57 16.76,4.57 18.03,5.84
GND on Top Layer: 6.25,22.94 10.03,22.94 10.03,17.65 6.25,17.65
GND on Top Layer: 16.1,28.42 18.24,28.42 18.24,25.68 16.1,25.68
GND on Top Layer: 6.48,7.49 11.05,7.49 11.05,5.97 6.48,5.97
GND on Top Layer: 0.97,7.85 6.1,7.86 6.1,10.9 0.97,10.9
GND on Top Layer: 31.39,9.17 31.39,6.69 30.84,5.97 28.45,5.97 28.45,7.8 29.82,9.17
GND on Top Layer: 26.01,5.71 26.01,7.24 24.99,7.24 24.99,7.14 21.51,7.14 20.83,6.22 20.83,4.95 25.02,4.95 25.02,5.71
GND on Inner1: 0.26,46 32.56,46 32.56,0.26 0.26,0.26

Small or netless copper shapes (teardrops, artwork), in the pictures only: 122 on Top Layer, 15 on Bottom Layer, 8 on Inner1

## Text on the board
Top Silkscreen Layer: TXD | RXD | GND | BTM | PelletMon V3 rev. A | RTERM | H | L | STATUS | RECEIVE | TRANSMIT | Krzysztof Strehlau | 03 2023 | JLCJLCJLCJLC | PWR
